# EAGLE schematic Address and TMP V1.0 (EAGLE 9.6.2)

## Sheet 1 of 3: BUS
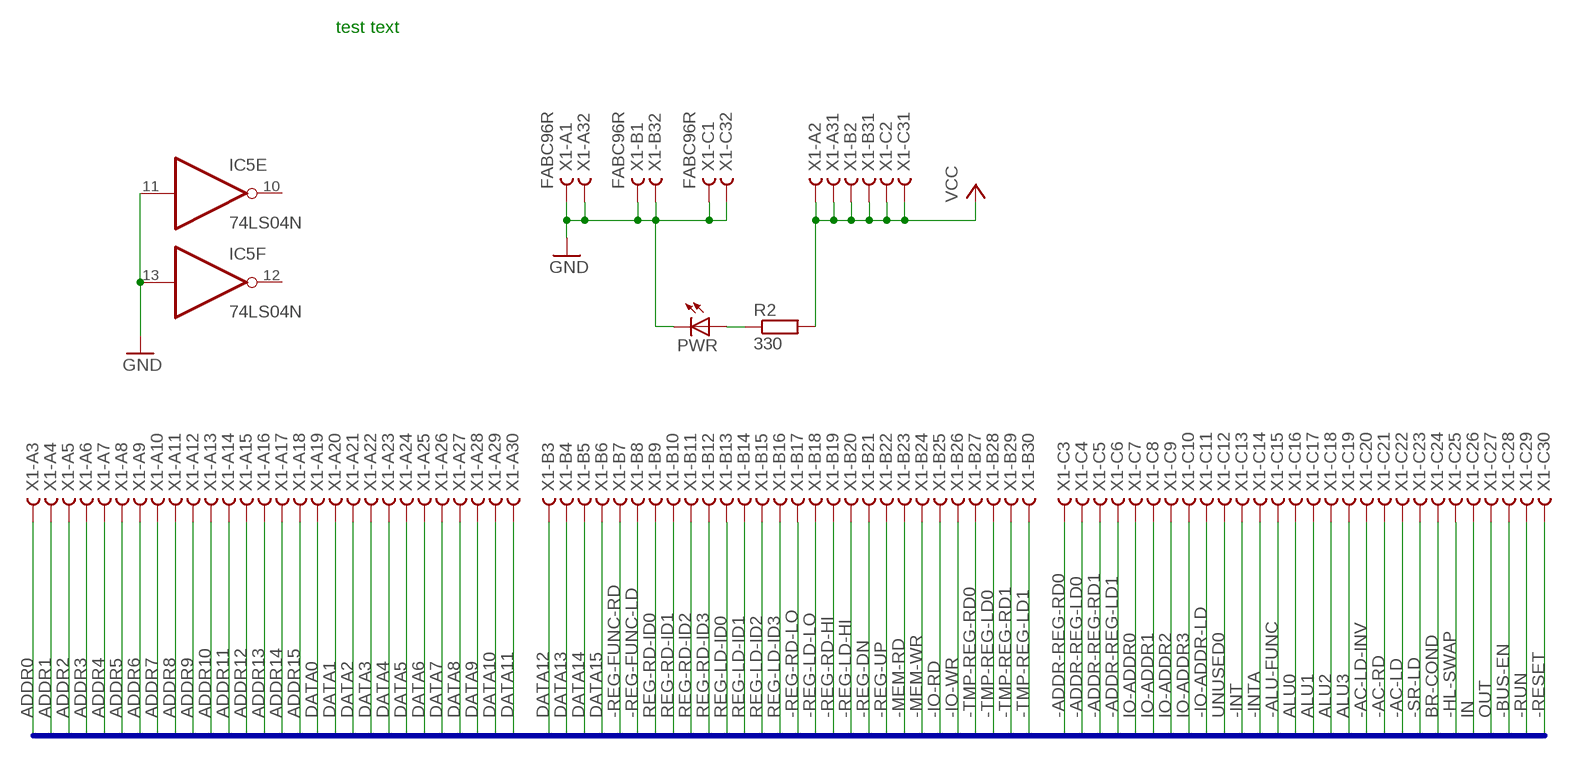
[diagram p0: schematic, sheet 1]

### Parts
IC5  74LS04N  [DIL14]
PWR  LED5MM  [LED5MM]
R2  330  R0207/10  [0207/10]
X1  FABC96R  [FABC96R]

### Nets
-AC-LD: X1.C22
-AC-LD-INV: X1.C20
-AC-RD: X1.C21
-ADDR-REG-LD0: X1.C4 ; also sheet 2
-ADDR-REG-LD1: X1.C6 ; also sheet 2
-ADDR-REG-RD0: X1.C3 ; also sheet 2
-ADDR-REG-RD1: X1.C5 ; also sheet 2
-ALU-FUNC: X1.C15
-BUS-EN: X1.C28
-HL-SWAP: X1.C25
-INT: X1.C13
-INTA: X1.C14
-IO-ADDR-LD: X1.C11
-IO-RD: X1.B25
-IO-WR: X1.B26
-MEM-RD: X1.B23
-MEM-WR: X1.B24
-REG-DN: X1.B21
-REG-FUNC-LD: X1.B8
-REG-FUNC-RD: X1.B7
-REG-LD-HI: X1.B20
-REG-LD-LO: X1.B18
-REG-RD-HI: X1.B19
-REG-RD-LO: X1.B17
-REG-UP: X1.B22
-RESET: X1.C30
-RUN: X1.C29
-SR-LD: X1.C23
-TMP-REG-LD0: X1.B28 ; also sheet 3
-TMP-REG-LD1: X1.B30 ; also sheet 3
-TMP-REG-RD0: X1.B27 ; also sheet 3
-TMP-REG-RD1: X1.B29 ; also sheet 3
ADDR0: X1.A3 ; also sheet 2
ADDR1: X1.A4 ; also sheet 2
ADDR2: X1.A5 ; also sheet 2
ADDR3: X1.A6 ; also sheet 2
ADDR4: X1.A7 ; also sheet 2
ADDR5: X1.A8 ; also sheet 2
ADDR6: X1.A9 ; also sheet 2
ADDR7: X1.A10 ; also sheet 2
ADDR8: X1.A11 ; also sheet 2
ADDR9: X1.A12 ; also sheet 2
ADDR10: X1.A13 ; also sheet 2
ADDR11: X1.A14 ; also sheet 2
ADDR12: X1.A15 ; also sheet 2
ADDR13: X1.A16 ; also sheet 2
ADDR14: X1.A17 ; also sheet 2
ADDR15: X1.A18 ; also sheet 2
ALU0: X1.C16
ALU1: X1.C17
ALU2: X1.C18
ALU3: X1.C19
BR-COND: X1.C24
DATA0: X1.A19 ; also sheet 2,3
DATA1: X1.A20 ; also sheet 2,3
DATA2: X1.A21 ; also sheet 2,3
DATA3: X1.A22 ; also sheet 2,3
DATA4: X1.A23 ; also sheet 2,3
DATA5: X1.A24 ; also sheet 2,3
DATA6: X1.A25 ; also sheet 2,3
DATA7: X1.A26 ; also sheet 2,3
DATA8: X1.A27 ; also sheet 2,3
DATA9: X1.A28 ; also sheet 2,3
DATA10: X1.A29 ; also sheet 2,3
DATA11: X1.A30 ; also sheet 2,3
DATA12: X1.B3 ; also sheet 2,3
DATA13: X1.B4 ; also sheet 2,3
DATA14: X1.B5 ; also sheet 2,3
DATA15: X1.B6 ; also sheet 2,3
GND: IC5.11(E:I) IC5.13(F:I) PWR.K(C) X1.A1 X1.A32 X1.B1 X1.B32 X1.C1 X1.C32 ; also sheet 2,3
IN: X1.C26
IO-ADDR0: X1.C7
IO-ADDR1: X1.C8
IO-ADDR2: X1.C9
IO-ADDR3: X1.C10
N$11: PWR.A R2.1
OUT: X1.C27
REG-LD-ID0: X1.B13
REG-LD-ID1: X1.B14
REG-LD-ID2: X1.B15
REG-LD-ID3: X1.B16
REG-RD-ID0: X1.B9
REG-RD-ID1: X1.B10
REG-RD-ID2: X1.B11
REG-RD-ID3: X1.B12
UNUSED0: X1.C12
VCC: R2.2 X1.A2 X1.A31 X1.B2 X1.B31 X1.C2 X1.C31
Unconnected: IC5.10(E:O) IC5.12(F:O)

### Buses
-AC-LD,-AC-LD-INV,-AC-RD,ADDR[0..15],-ADDR-REG-LD[0..1],-ADDR-REG-RD[0..1],ALU[0..3],-ALU-FUNC,BR-COND,-BUS-EN,DATA[0..15],-HL-SWAP,IN,-INT,-INTA,IO-ADDR[0..3],-IO-ADDR-LD,-IO-RD,-IO-WR,-MEM-RD,-MEM-WR,OUT,-REG-DN,-REG-FUNC-LD,-REG-FUNC-RD,-REG-LD-HI,REG-LD-ID[0..3],-REG-LD-LO,-REG-RD-HI,REG-RD-ID[0..3],-REG-RD-LO,-REG-UP,-RESET,-RUN,-SR-LD,-TMP-REG-LD[0..1],-TMP-REG-RD[0..1],UNUSED0

### Notes on the sheet
- test text

## Sheet 2 of 3: address registers
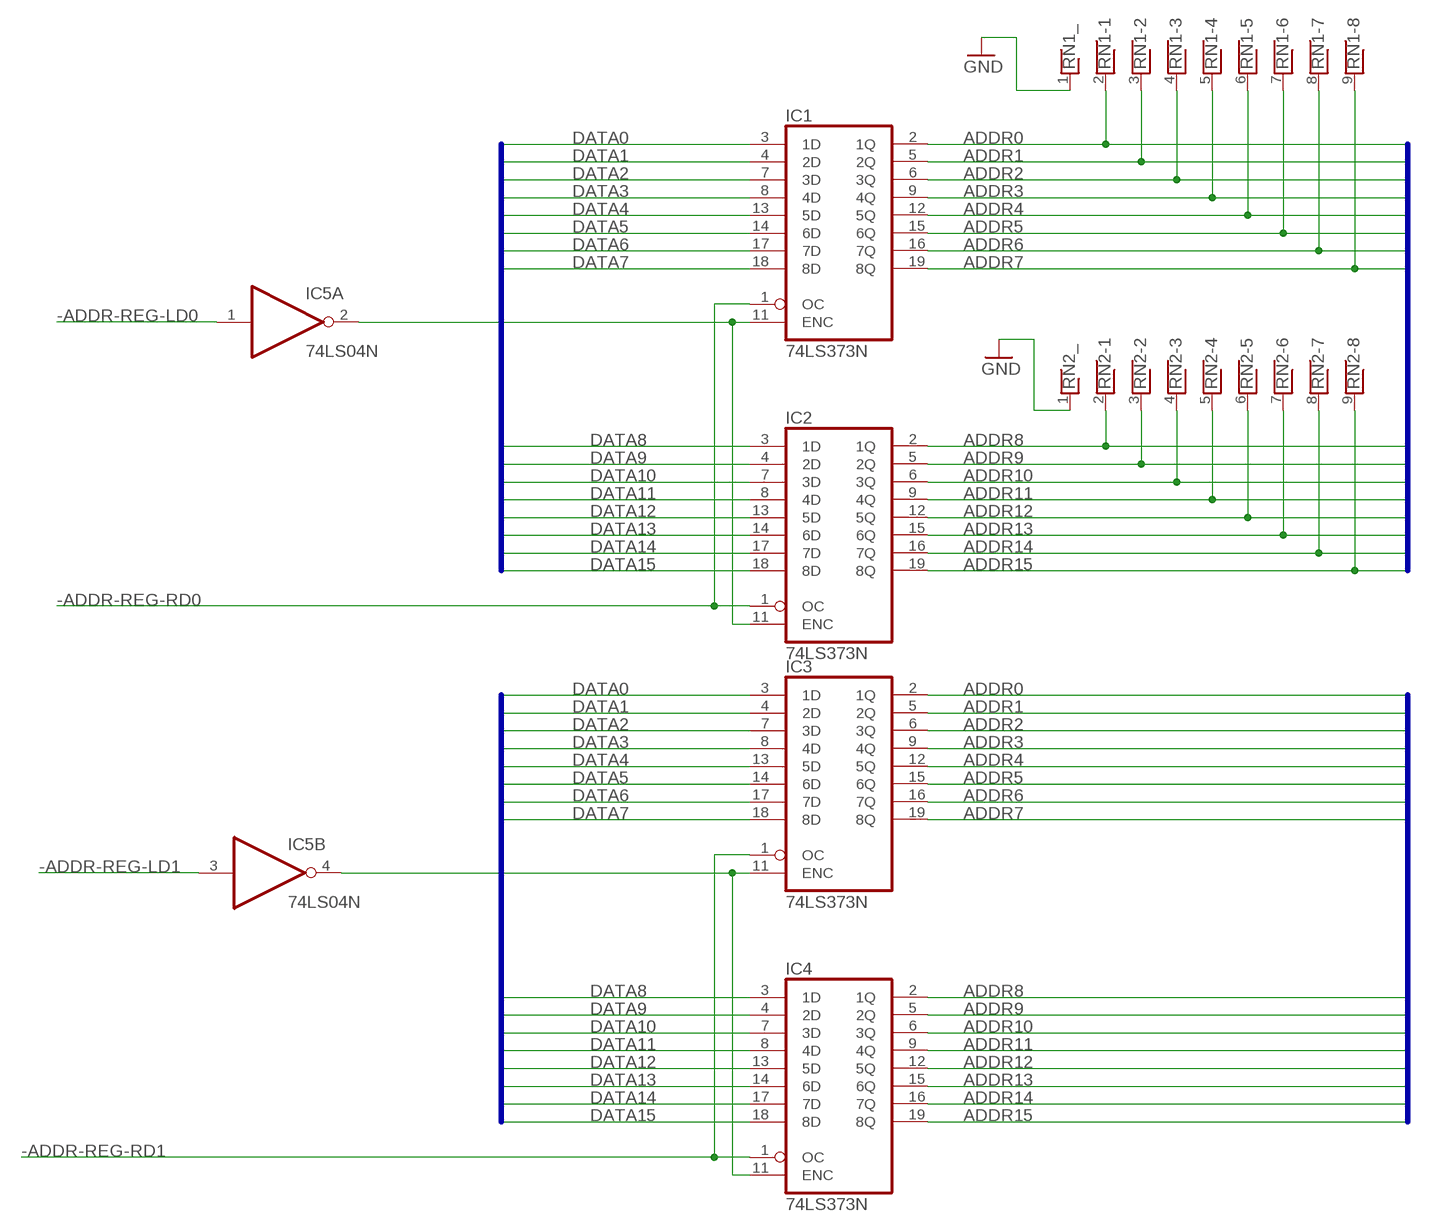
[diagram p1: schematic, sheet 2]

### Parts
IC1  74LS373N  [DIL20]
IC2  74LS373N  [DIL20]
IC3  74LS373N  [DIL20]
IC4  74LS373N  [DIL20]
RN1  RNX8  [RN-9]
RN2  RNX8  [RN-9]

### Nets
-ADDR-REG-LD0: IC5.1(A:I) ; also sheet 1
-ADDR-REG-LD1: IC5.3(B:I) ; also sheet 1
-ADDR-REG-RD0: IC1.1(OC) IC2.1(OC) ; also sheet 1
-ADDR-REG-RD1: IC3.1(OC) IC4.1(OC) ; also sheet 1
ADDR0: IC1.2(1Q) IC3.2(1Q) RN1.2 ; also sheet 1
ADDR1: IC1.5(2Q) IC3.5(2Q) RN1.3 ; also sheet 1
ADDR2: IC1.6(3Q) IC3.6(3Q) RN1.4 ; also sheet 1
ADDR3: IC1.9(4Q) IC3.9(4Q) RN1.5 ; also sheet 1
ADDR4: IC1.12(5Q) IC3.12(5Q) RN1.6 ; also sheet 1
ADDR5: IC1.15(6Q) IC3.15(6Q) RN1.7 ; also sheet 1
ADDR6: IC1.16(7Q) IC3.16(7Q) RN1.8 ; also sheet 1
ADDR7: IC1.19(8Q) IC3.19(8Q) RN1.9 ; also sheet 1
ADDR8: IC2.2(1Q) IC4.2(1Q) RN2.2 ; also sheet 1
ADDR9: IC2.5(2Q) IC4.5(2Q) RN2.3 ; also sheet 1
ADDR10: IC2.6(3Q) IC4.6(3Q) RN2.4 ; also sheet 1
ADDR11: IC2.9(4Q) IC4.9(4Q) RN2.5 ; also sheet 1
ADDR12: IC2.12(5Q) IC4.12(5Q) RN2.6 ; also sheet 1
ADDR13: IC2.15(6Q) IC4.15(6Q) RN2.7 ; also sheet 1
ADDR14: IC2.16(7Q) IC4.16(7Q) RN2.8 ; also sheet 1
ADDR15: IC2.19(8Q) IC4.19(8Q) RN2.9 ; also sheet 1
DATA0: IC1.3(1D) IC3.3(1D) ; also sheet 1,3
DATA1: IC1.4(2D) IC3.4(2D) ; also sheet 1,3
DATA2: IC1.7(3D) IC3.7(3D) ; also sheet 1,3
DATA3: IC1.8(4D) IC3.8(4D) ; also sheet 1,3
DATA4: IC1.13(5D) IC3.13(5D) ; also sheet 1,3
DATA5: IC1.14(6D) IC3.14(6D) ; also sheet 1,3
DATA6: IC1.17(7D) IC3.17(7D) ; also sheet 1,3
DATA7: IC1.18(8D) IC3.18(8D) ; also sheet 1,3
DATA8: IC2.3(1D) IC4.3(1D) ; also sheet 1,3
DATA9: IC2.4(2D) IC4.4(2D) ; also sheet 1,3
DATA10: IC2.7(3D) IC4.7(3D) ; also sheet 1,3
DATA11: IC2.8(4D) IC4.8(4D) ; also sheet 1,3
DATA12: IC2.13(5D) IC4.13(5D) ; also sheet 1,3
DATA13: IC2.14(6D) IC4.14(6D) ; also sheet 1,3
DATA14: IC2.17(7D) IC4.17(7D) ; also sheet 1,3
DATA15: IC2.18(8D) IC4.18(8D) ; also sheet 1,3
GND: RN1.1 RN2.1 ; also sheet 1,3
N$1: IC1.11(ENC) IC2.11(ENC) IC5.2(A:O)
N$2: IC3.11(ENC) IC4.11(ENC) IC5.4(B:O)

### Buses
DATA0,DATA1,DATA2,DATA3,DATA4,DATA5,DATA6,DATA7,DATA8,DATA9,DATA10,DATA11,DATA12,DATA13,DATA14,DATA15
ADDR0,ADDR1,ADDR2,ADDR3,ADDR4,ADDR5,ADDR6,ADDR7,ADDR8,ADDR9,ADDR10,ADDR11,ADDR12,ADDR13,ADDR14,ADDR15,DATA0,DATA1,DATA2,DATA3,DATA4,DATA5,DATA6,DATA7,DATA8,DATA9,DATA10,DATA11,DATA12,DATA13,DATA14,DATA15

## Sheet 3 of 3: TMP Registers
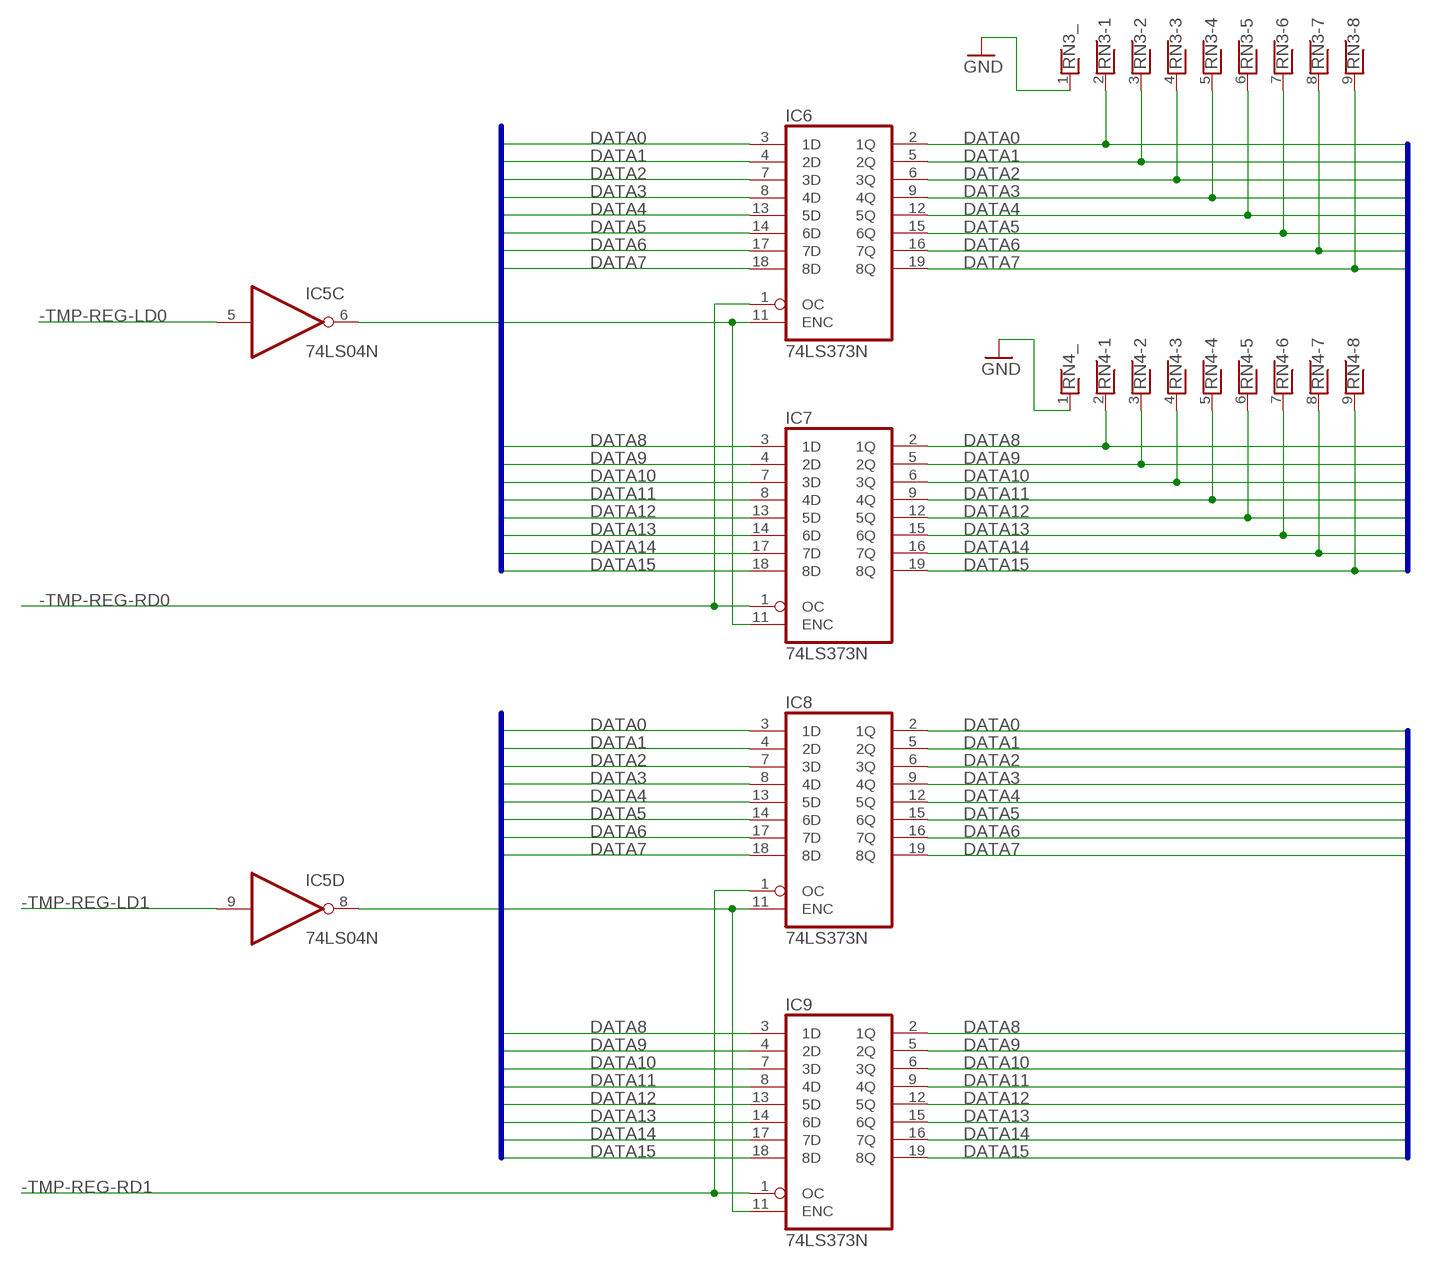
[diagram p2: schematic, sheet 3]

### Parts
IC6  74LS373N  [DIL20]
IC7  74LS373N  [DIL20]
IC8  74LS373N  [DIL20]
IC9  74LS373N  [DIL20]
RN3  RNX8  [RN-9]
RN4  RNX8  [RN-9]

### Nets
-TMP-REG-LD0: IC5.5(C:I) ; also sheet 1
-TMP-REG-LD1: IC5.9(D:I) ; also sheet 1
-TMP-REG-RD0: IC6.1(OC) IC7.1(OC) ; also sheet 1
-TMP-REG-RD1: IC8.1(OC) IC9.1(OC) ; also sheet 1
DATA0: IC6.2(1Q) IC6.3(1D) IC8.2(1Q) IC8.3(1D) RN3.2 ; also sheet 1,2
DATA1: IC6.4(2D) IC6.5(2Q) IC8.4(2D) IC8.5(2Q) RN3.3 ; also sheet 1,2
DATA2: IC6.6(3Q) IC6.7(3D) IC8.6(3Q) IC8.7(3D) RN3.4 ; also sheet 1,2
DATA3: IC6.8(4D) IC6.9(4Q) IC8.8(4D) IC8.9(4Q) RN3.5 ; also sheet 1,2
DATA4: IC6.12(5Q) IC6.13(5D) IC8.12(5Q) IC8.13(5D) RN3.6 ; also sheet 1,2
DATA5: IC6.14(6D) IC6.15(6Q) IC8.14(6D) IC8.15(6Q) RN3.7 ; also sheet 1,2
DATA6: IC6.16(7Q) IC6.17(7D) IC8.16(7Q) IC8.17(7D) RN3.8 ; also sheet 1,2
DATA7: IC6.18(8D) IC6.19(8Q) IC8.18(8D) IC8.19(8Q) RN3.9 ; also sheet 1,2
DATA8: IC7.2(1Q) IC7.3(1D) IC9.2(1Q) IC9.3(1D) RN4.2 ; also sheet 1,2
DATA9: IC7.4(2D) IC7.5(2Q) IC9.4(2D) IC9.5(2Q) RN4.3 ; also sheet 1,2
DATA10: IC7.6(3Q) IC7.7(3D) IC9.6(3Q) IC9.7(3D) RN4.4 ; also sheet 1,2
DATA11: IC7.8(4D) IC7.9(4Q) IC9.8(4D) IC9.9(4Q) RN4.5 ; also sheet 1,2
DATA12: IC7.12(5Q) IC7.13(5D) IC9.12(5Q) IC9.13(5D) RN4.6 ; also sheet 1,2
DATA13: IC7.14(6D) IC7.15(6Q) IC9.14(6D) IC9.15(6Q) RN4.7 ; also sheet 1,2
DATA14: IC7.16(7Q) IC7.17(7D) IC9.16(7Q) IC9.17(7D) RN4.8 ; also sheet 1,2
DATA15: IC7.18(8D) IC7.19(8Q) IC9.18(8D) IC9.19(8Q) RN4.9 ; also sheet 1,2
GND: RN3.1 RN4.1 ; also sheet 1,2
N$3: IC5.6(C:O) IC6.11(ENC) IC7.11(ENC)
N$4: IC5.8(D:O) IC8.11(ENC) IC9.11(ENC)

### Buses
DATABUS:DATA[0..15]

## Power pins joined to a net without a drawn wire
GND: IC1.10(GND) IC2.10(GND) IC3.10(GND) IC4.10(GND) IC5.7(P:GND) IC6.10(GND) IC7.10(GND) IC8.10(GND) IC9.10(GND)
VCC: IC1.20(VCC) IC2.20(VCC) IC3.20(VCC) IC4.20(VCC) IC5.14(P:VCC) IC6.20(VCC) IC7.20(VCC) IC8.20(VCC) IC9.20(VCC)

## Library data of the parts
IC1-IC4 IC6-IC9 = 74xx-us:74*373: Octal D type transparent LATCH, edge triggered
IC5 = 74xx-us:74*04: Hex INVERTER
PWR = led:LED: LED OSRAM: - CHIPLED LG R971, LG N971, LY N971, LG Q971, LY Q971, LO R971, LY R971 LH N974, LH R974 LS Q976, LO Q976, LY Q976 LO Q996 - Hyper CHIPLED LW Q18S LB Q993, LB Q99A, LB R99A - SideLED LS A670, LO A670, LY A670, LG A670, LP A670 LB A673, LV A673, LT A673, LW A673 LH A674 LY A675 LS A676, LA A676, LO A676, LY A676, LW A676 LS A679, LY A679, LG A679 - Hyper Micro SIDELED® LS Y876, LA Y876, LO Y876, LY Y876 LT Y87S - SmartLED LW L88C, LW L88S LB L89C, LB L89S, LG L890 LS L89K, LO L89K, LY L89K LS L896, LA L896, LO L896, LY L896 - TOPLED LS T670, LO T670, LY T670, LG T670, LP T670 LSG T670, LSP T670, LSY T670, LOP T670, LYG T670 LG T671, LOG T671, LSG T671 LB T673, LV T673, LT T673, LW T673 LH T674 LS T676, LA T676, LO T676, LY T676, LB T676, LH T676, LSB T676, LW T676 LB T67C, LV T67C, LT T67C, LS T67K, LO T67K, LY T67K, LW E67C LS E67B, LA E67B, LO E67B, LY E67B, LB E67C, LV E67C, LT E67C LW T67C LS T679, LY T679, LG T679 LS T770, LO T770, LY T770, LG T770, LP T770 LB T773, LV T773, LT T773, LW T773 LH T774 LS E675, LA E675, LY E675, LS T675 LS T776, LA T776, LO T776, LY T776, LB T776 LHGB T686 LT T68C, LB T68C - Hyper Mini TOPLED® LB M676 - Mini TOPLED Santana® LG M470 LS M47K, LO M47K, LY M47K Source: http://www.osram.convergy.de LUXEON: - LUMILED® LXK2-PW12-R00, LXK2-PW12-S00, LXK2-PW14-U00, LXK2-PW14-V00 LXK2-PM12-R00, LXK2-PM12-S00, LXK2-PM14-U00 LXK2-PE12-Q00, LXK2-PE12-R00, LXK2-PE12-S00, LXK2-PE14-T00, LXK2-PE14-U00 LXK2-PB12-K00, LXK2-PB12-L00, LXK2-PB12-M00, LXK2-PB14-N00, LXK2-PB14-P00, LXK2-PB14-Q00 LXK2-PR12-L00, LXK2-PR12-M00, LXK2-PR14-Q00, LXK2-PR14-R00 LXK2-PD12-Q00, LXK2-PD12-R00, LXK2-PD12-S00 LXK2-PH12-R00, LXK2-PH12-S00 LXK2-PL12-P00, LXK2-PL12-Q00, LXK2-PL12-R00 Source: www.luxeon.com KINGBRIGHT: KA-3528ASYC Source: www.kingbright.com
R2 = eagle-ltspice:R: RESISTOR, European symbol; SPICEMODEL: NONE; SPICEPREFIX: R
RN1-RN4 = resistor-net:RNX8: RESISTOR NETWORK; OC_FARNELL: unknown; OC_NEWARK: unknown
X1 = con-vg:FABC96R: CONNECTOR female, 96 pins, type R, rows ABC, grid 2.54 mm

## Net classes
1 GND: width 1 mm
2 5V: width 1 mm